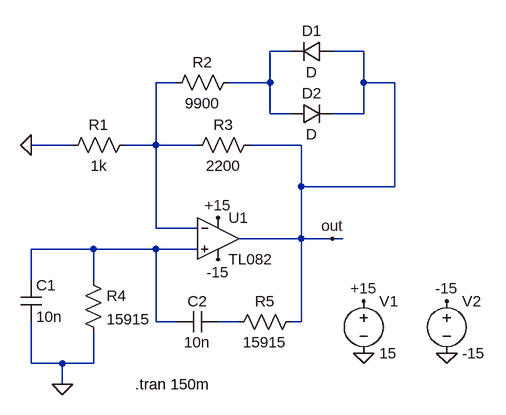
[diagram p0: schematic BangBang.asc]
BangBang.asc, the LTspice schematic file:
Version 4
SHEET 1 880 680
WIRE 352 -48 320 -48
WIRE 464 -48 416 -48
WIRE 176 0 144 0
WIRE 320 0 320 -48
WIRE 320 0 256 0
WIRE 464 0 464 -48
WIRE 512 0 464 0
WIRE 320 48 320 0
WIRE 352 48 320 48
WIRE 464 48 464 0
WIRE 464 48 416 48
WIRE 16 96 -48 96
WIRE 144 96 144 0
WIRE 144 96 96 96
WIRE 208 96 144 96
WIRE 368 96 288 96
WIRE 368 160 368 96
WIRE 512 160 512 0
WIRE 512 160 368 160
WIRE 144 224 144 96
WIRE 208 224 144 224
WIRE 368 240 368 160
WIRE 368 240 272 240
WIRE 416 240 368 240
WIRE 432 240 416 240
WIRE 48 256 -48 256
WIRE 144 256 48 256
WIRE 208 256 144 256
WIRE -48 304 -48 256
WIRE 48 304 48 256
WIRE 144 368 144 256
WIRE 176 368 144 368
WIRE 272 368 240 368
WIRE 368 368 368 240
WIRE 368 368 352 368
WIRE -48 432 -48 368
WIRE 0 432 -48 432
WIRE 48 432 48 384
WIRE 48 432 0 432
WIRE 0 464 0 432
FLAG 240 208 +15
FLAG 240 272 -15
FLAG 0 464 0
FLAG 416 240 out
FLAG 464 416 0
FLAG 592 416 0
FLAG 464 336 +15
FLAG 592 336 -15
FLAG -48 96 0
SYMBOL TL082 240 240 R0
SYMATTR InstName U1
SYMBOL res 304 80 R90
WINDOW 0 0 56 VBottom 2
WINDOW 3 32 56 VTop 2
SYMATTR InstName R3
SYMATTR Value 2200
SYMBOL res 32 288 R0
SYMATTR InstName R4
SYMATTR Value 15915
SYMBOL cap -64 304 R0
SYMATTR InstName C1
SYMATTR Value 10n
SYMBOL res 368 352 R90
WINDOW 0 0 56 VBottom 2
WINDOW 3 32 56 VTop 2
SYMATTR InstName R5
SYMATTR Value 15915
SYMBOL cap 240 352 R90
WINDOW 0 0 32 VBottom 2
WINDOW 3 32 32 VTop 2
SYMATTR InstName C2
SYMATTR Value 10n
SYMBOL voltage 464 320 R0
WINDOW 123 0 0 Left 0
WINDOW 39 0 0 Left 0
SYMATTR InstName V1
SYMATTR Value 15
SYMBOL voltage 592 320 R0
WINDOW 123 0 0 Left 0
WINDOW 39 0 0 Left 0
SYMATTR InstName V2
SYMATTR Value -15
SYMBOL res 272 -16 R90
WINDOW 0 0 56 VBottom 2
WINDOW 3 32 56 VTop 2
SYMATTR InstName R2
SYMATTR Value 9900
SYMBOL diode 416 -64 R90
WINDOW 0 0 32 VBottom 2
WINDOW 3 32 32 VTop 2
SYMATTR InstName D1
SYMBOL diode 352 64 R270
WINDOW 0 32 32 VTop 2
WINDOW 3 0 32 VBottom 2
SYMATTR InstName D2
SYMBOL res 112 80 R90
WINDOW 0 0 56 VBottom 2
WINDOW 3 32 56 VTop 2
SYMATTR InstName R1
SYMATTR Value 1k
TEXT 112 464 Left 2 !.tran 150m

The netlist it stands for:
* BangBang.asc
* U1: TL082 (symbol TL082 not available, pins judged from their places): In+=N003 In-=N002 V+=+15 V-=-15 OUT=out
R3 out N002 2200
R4 N003 0 15915
C1 N003 0 10n
R5 out N004 15915
C2 N004 N003 10n
V1 +15 0 15
V2 -15 0 -15
R2 N001 N002 9900
D1 out N001 D
D2 N001 out D
R1 N002 0 1k
.model D D
.lib standard.dio
.tran 150m
.backanno
.end